# EAGLE schematic trehacklab_doorbell (EAGLE 7.4.0)
Tampere hacklab doorbell
CNAME: Tampere Hacklab Doorbell; CREVISION: V1; DESIGNER: Ketturi
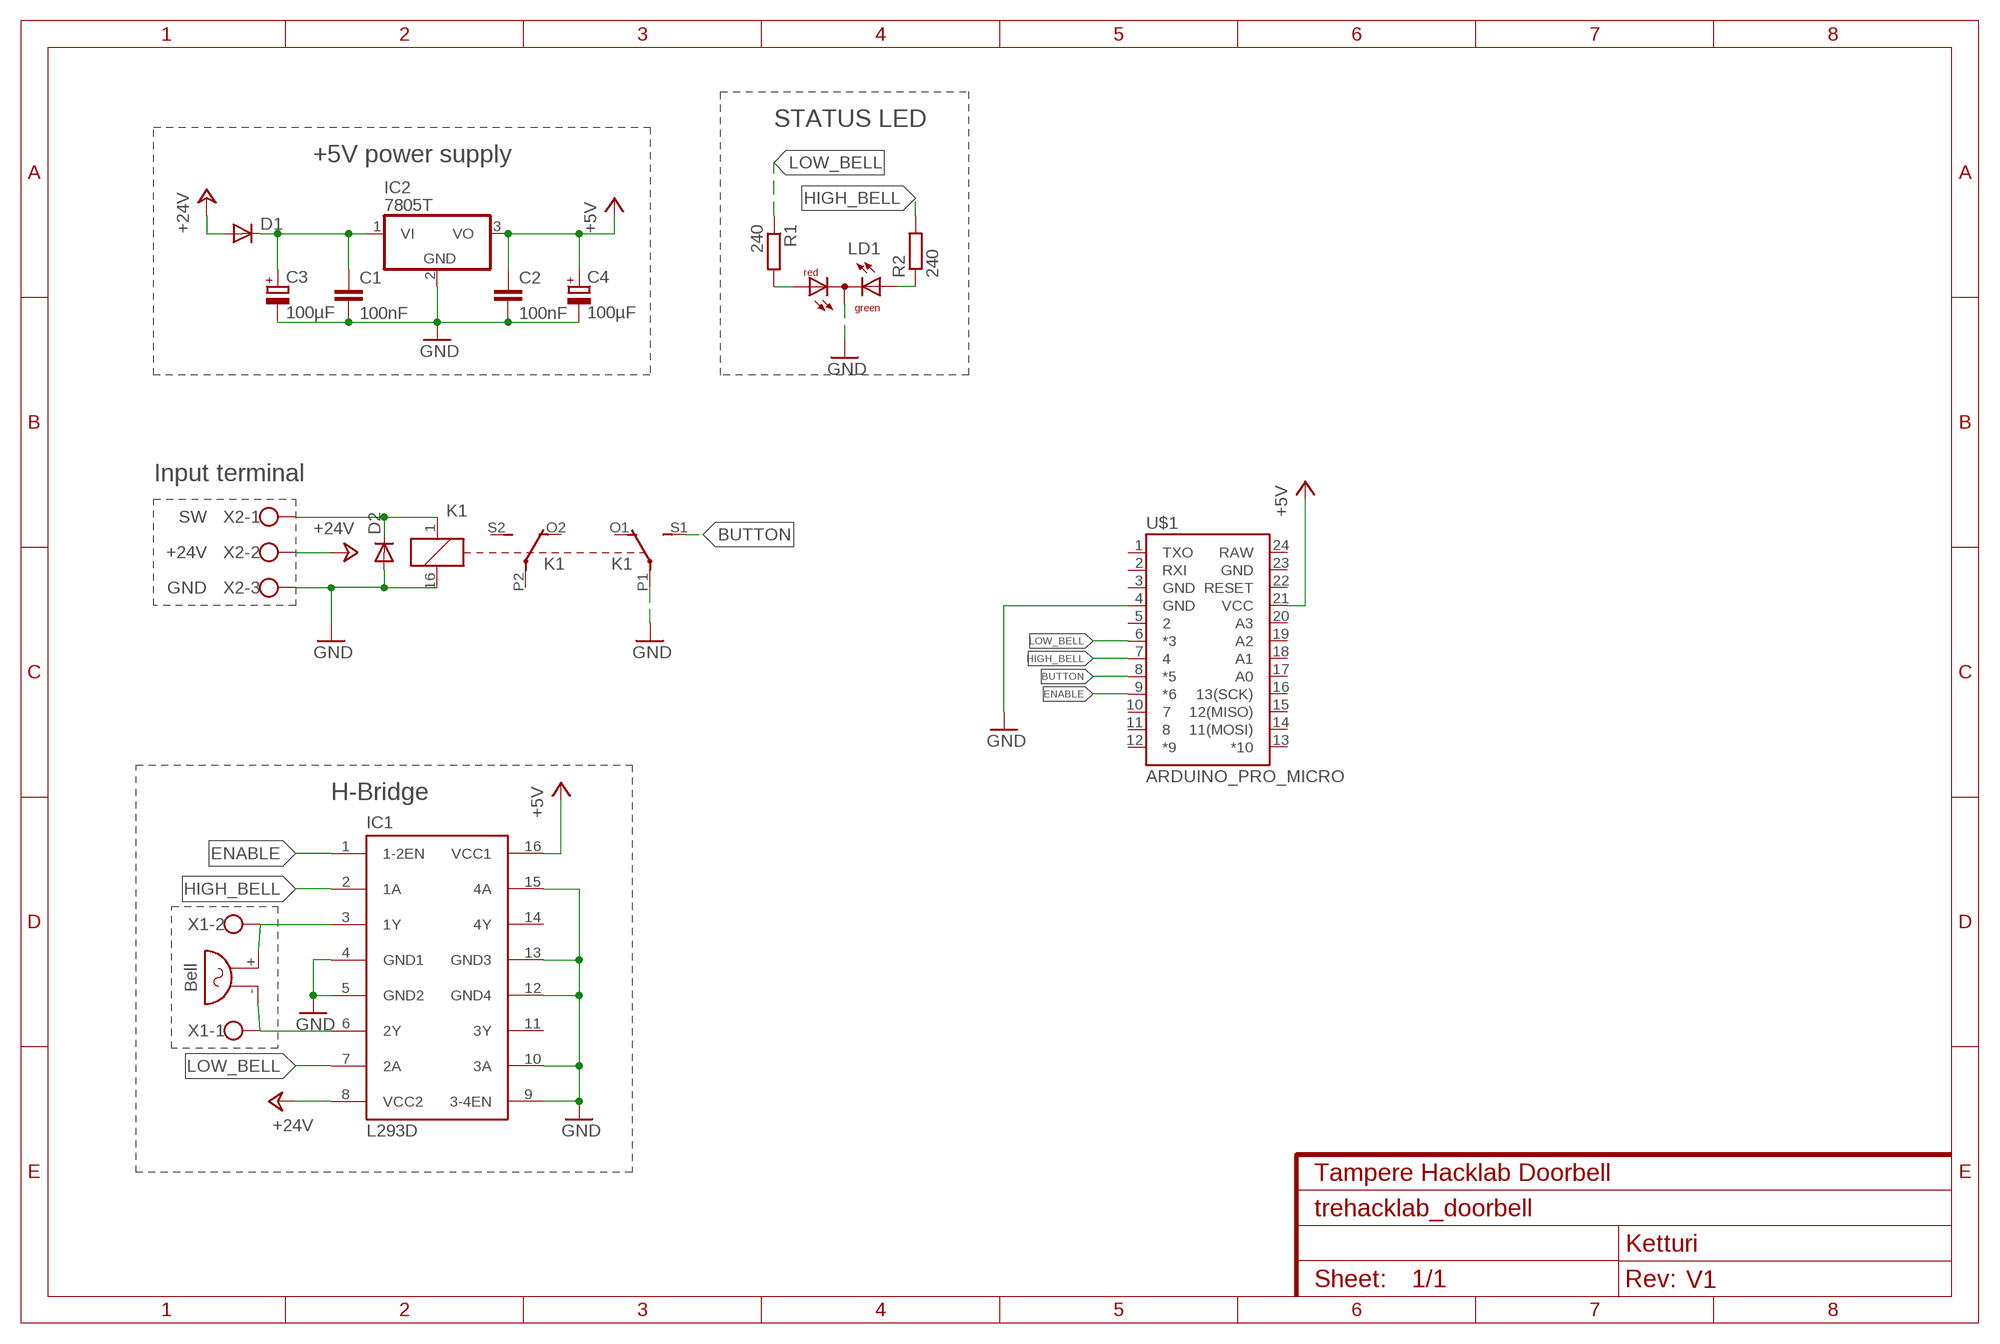
[diagram p0: schematic, sheet 1]

## Parts
C1  100nF  C-EU025-024X044  [C025-024X044]
C2  100nF  C-EU025-024X044  [C025-024X044]
C3  100µF  CPOL-EUE3.5-8  [E3,5-8]
C4  100µF  CPOL-EUE3.5-8  [E3,5-8]
D1  1N5624  [DO201-15]
D2  1N5624  [DO201-15]
IC1  L293D  [DIL16]
IC2  7805T  [TO220H]
K1  351  [351]
LD1  DUOLED-RG-C  [DUOLED-C-5MM]
R1  240  R-EU_0204/2V  [0204V]
R2  240  R-EU_0204/2V  [0204V]
SG1  Bell  F/QMX  [F/QMX]
U$1  ARDUINO_PRO_MICRO  [ARDUINO_PRO_MICRO]
X1  W239-302  [W239-302]
X2  W239-103  [W239-103]

## Nets
+5V: C2.1 C4.+ IC1.16(VCC1) IC2.3(VO) U$1.21(VCC)
+24V: D1.A IC1.8(VCC2) X2.2
BUTTON: K1.S1(2:S) U$1.8(*5)
ENABLE: IC1.1(1-2EN) U$1.9(*6)
GND: C1.2 C2.2 C3.- C4.- D2.A IC1.4(GND1) IC1.5(GND2) IC1.9(3-4EN) IC1.10(3A) IC1.12(GND4) IC1.13(GND3) IC1.15(4A) IC2.2(GND) K1.16 K1.P1(2:P) LD1.C U$1.4(GND) X2.3
HIGH_BELL: IC1.2(1A) R2.2 U$1.7
LOW_BELL: IC1.7(2A) R1.1 U$1.6(*3)
N$1: D2.C K1.1 X2.1
N$2: C1.1 C3.+ D1.C IC2.1(VI)
N$3: LD1.AR R1.2
N$4: LD1.AX(AG) R2.1
N$5: IC1.3(1Y) SG1.+ X1.2
N$6: IC1.6(2Y) SG1.- X1.1
Unconnected: IC1.11(3Y) IC1.14(4Y) K1.O1(2:O) K1.O2(3:O) K1.P2(3:P) K1.S2(3:S) U$1.1(TXO) U$1.2(RXI) U$1.3(GND) U$1.5 U$1.10 U$1.11 U$1.12(*9) U$1.13(*10) U$1.14(11(MOSI)) U$1.15(12(MISO)) U$1.16(13(SCK)) U$1.17(A0) U$1.18(A1) U$1.19(A2) U$1.20(A3) U$1.22(RESET) U$1.23(GND) U$1.24(RAW)

## Notes on the sheet
- STATUS LED
- +5V power supply
- Input terminal
- SW
- +24V
- GND
- H-Bridge

## Library data of the parts
C1 C2 = resistor:C-EU: CAPACITOR, European symbol
C3 C4 = resistor:CPOL-EU: POLARIZED CAPACITOR, European symbol
D1 D2 = diode:1N5624: DIODE controlled avalanche rectifier
IC1 = st-microelectronics:L293D: PUSH-PULL 4 CHANNEL DRIVER; MPN: L293D; OC_FARNELL: 9589619; OC_NEWARK: 56P8249
IC2 = linear:78*: Positive VOLTAGE REGULATOR Source: http://cache.national.com/ds/LM/LM78L05.pdf http://www.fairchildsemi.com/ds/LM/LM7805.pdf
K1 = relay:351: RELAY 2 x switch, Omron; OC_FARNELL: unknown; OC_NEWARK: unknown
LD1 = led:DUOLED-RG-C: DUO LED 2 colors (red/green), 5 mm, round, common Cathode www.ligitek.com or other producers.
R1 R2 = resistor:R-EU_: RESISTOR, European symbol
SG1 = buzzer:F/QMX: BUZZER Source: Buerklin; OC_FARNELL: unknown; OC_NEWARK: unknown
U$1 = SparkFun-Boards:ARDUINO_PRO_MICRO
X1 = con-wago-500:W239-302: WAGO SCREW CLAMP; OC_FARNELL: unknown; OC_NEWARK: unknown
X2 = con-wago-500:W239-103: WAGO SCREW CLAMP; MPN: 239-103; OC_FARNELL: unknown; OC_NEWARK: 33M7170